# EasyEDA Pro project APFC_硬件.eprj

# Schematic Schematic1
Board Name: UCC28180; Create Date: 2025-06-14; Page Name: P1; Project Name: APFC_硬件; Schematic Name: Schematic1; Update Date: 2025-07-09; Company: 嘉立创EDA; Page Size: A4; Version: V1.0
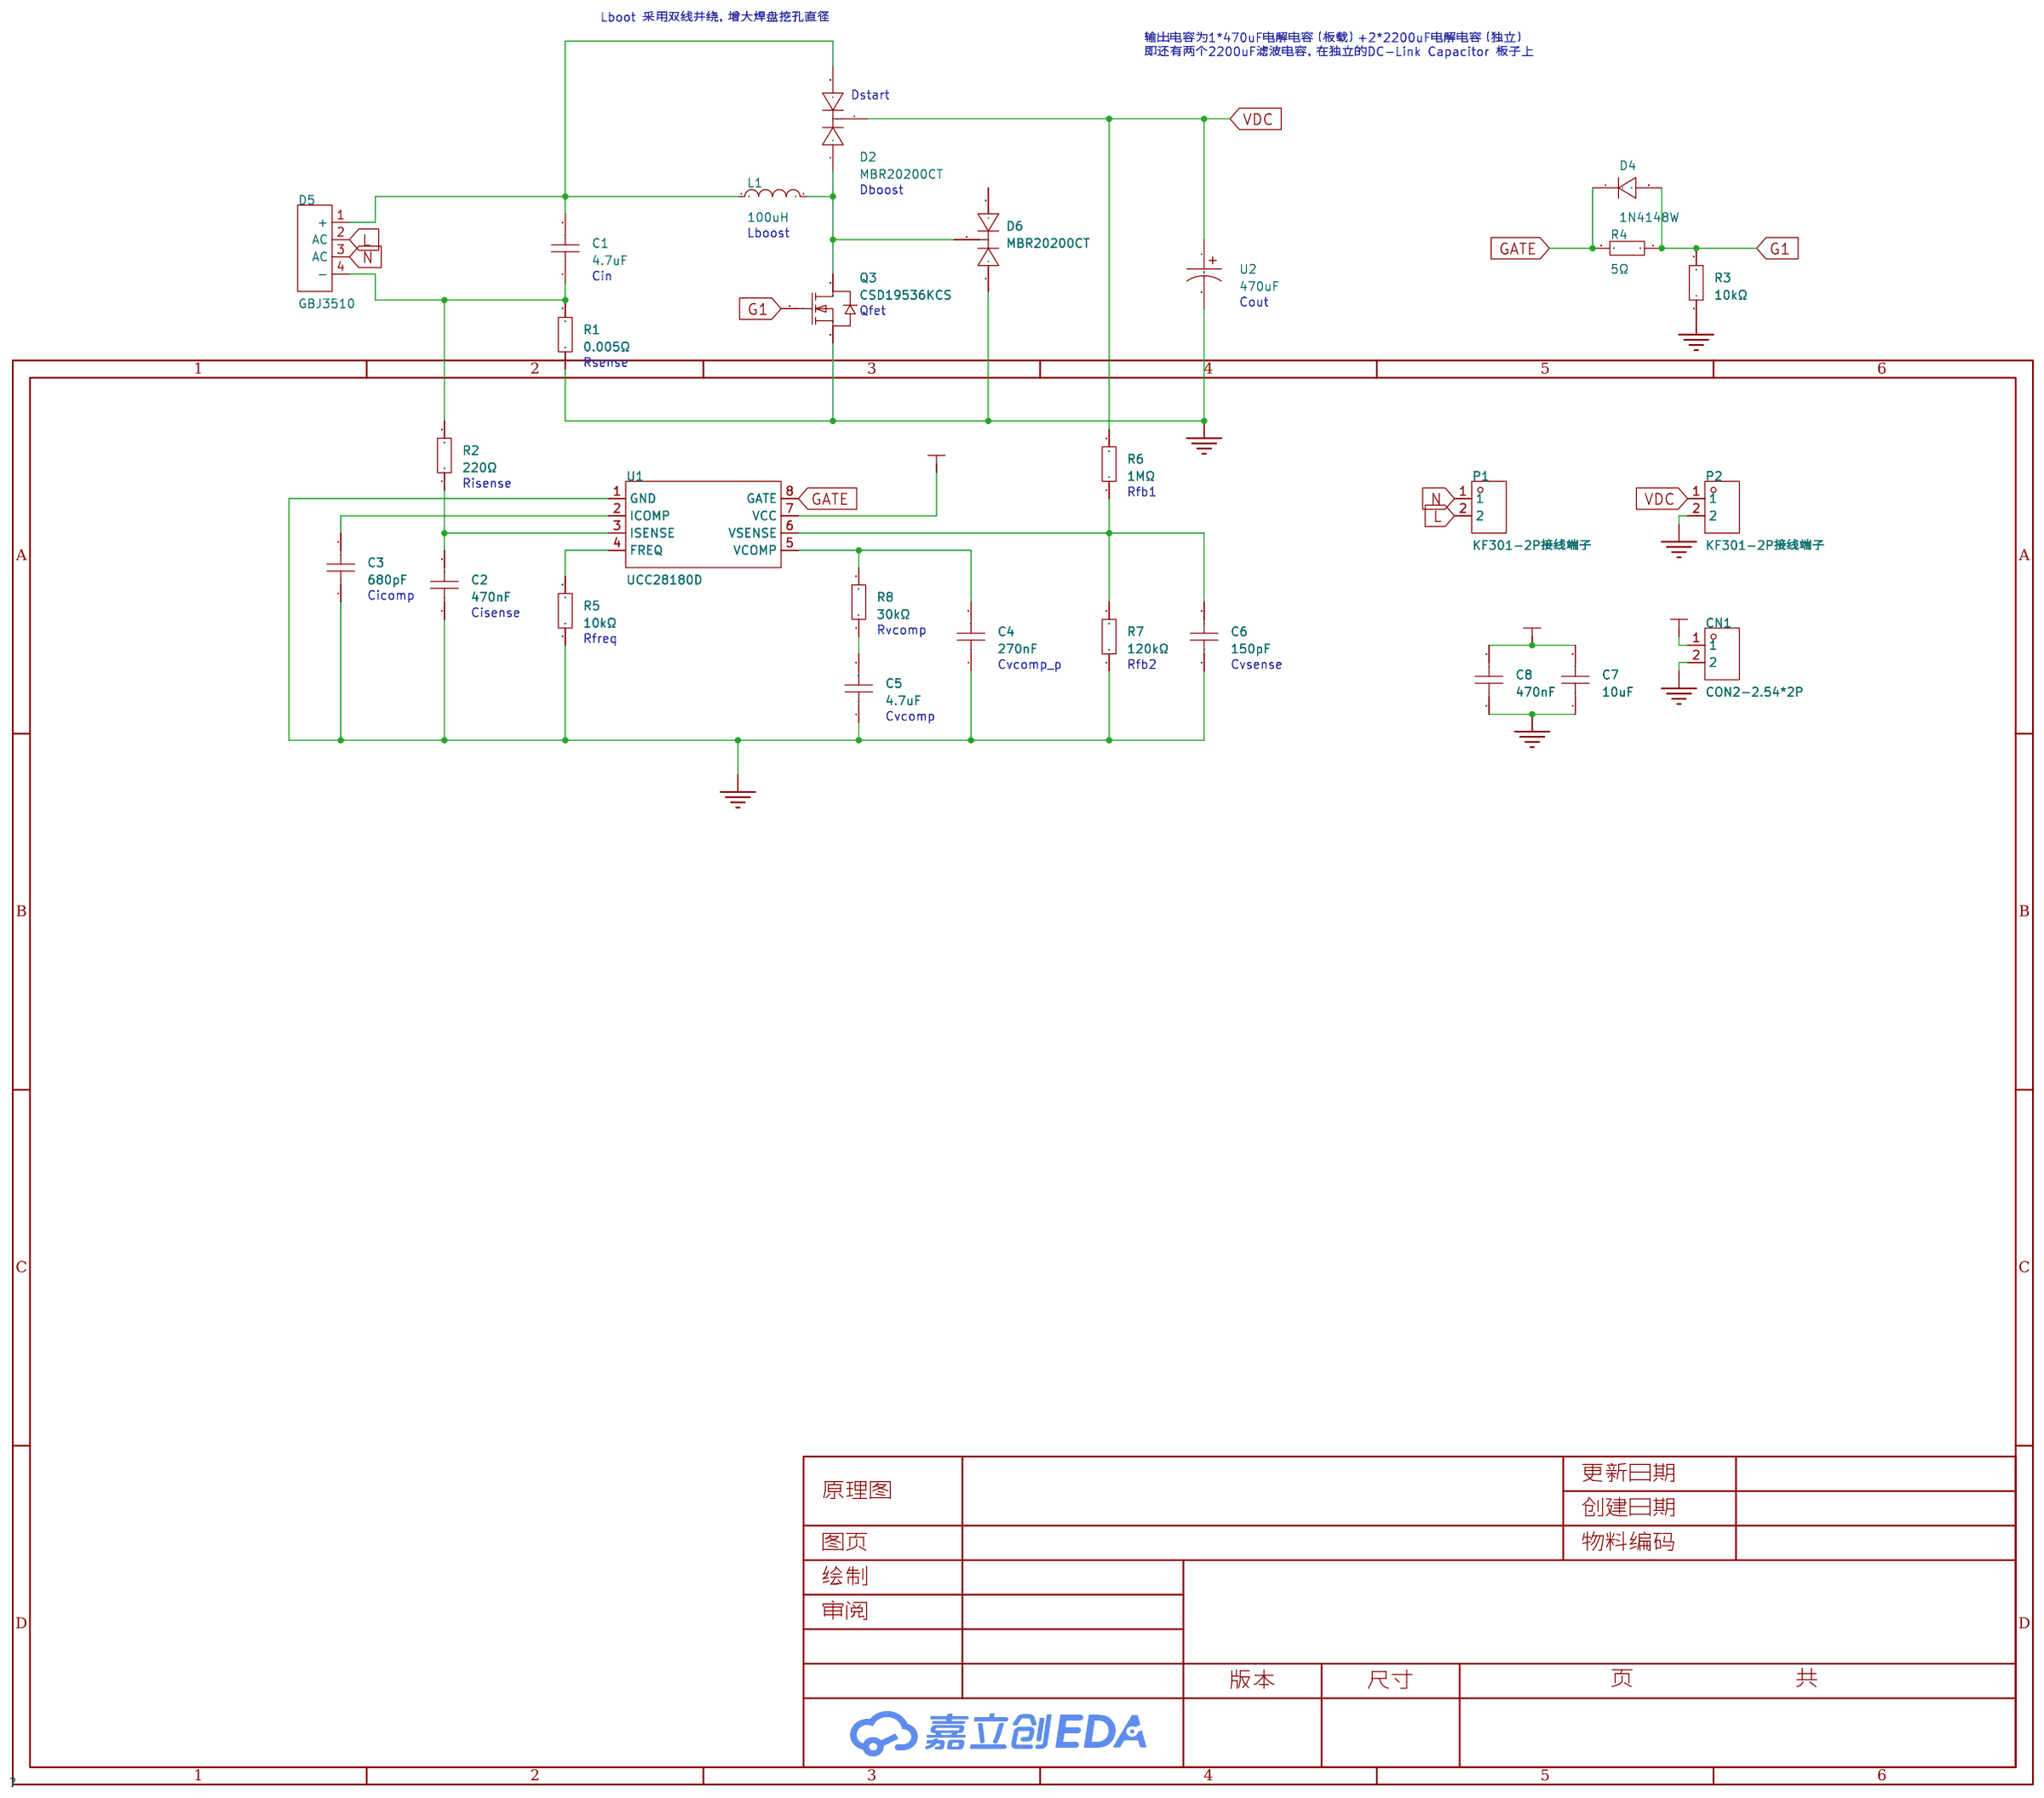
[diagram p0: schematic sheet]

## Parts
C1  4.7uF  [CAP-TH_L27.5-W12.0-P25.00-D1.0]
C2  470nF  [C0805]
C3  680pF  [C0805]
C4  270nF  [C0805]
C5  4.7uF  [C0805]
C6  150pF  [C0805]
C7  10uF  [C0805]
C8  470nF  [C0805]
CN1  CON2-2.54*2P  [CONN-TH_2P-P2.54-V]
D2  MBR20200CT  [TO-220AB-3_L10.4-W4.6-P2.54-T]
D4  1N4148W  [SOD-123F_L2.7-W1.6-LS3.8-RD]
D5  GBJ3510  [GBJ_4P-L30.0-W4.6-L]
D6  MBR20200CT  [TO-220AB-3_L10.4-W4.6-P2.54-T]
L1  100uH  [IND-TH_L33.0-W16.0-P17.00-D1.5]
P1  KF301-2P接线端子  [CONN-TH_XY301V-A-5.0-2P]
P2  KF301-2P接线端子  [CONN-TH_XY301V-A-5.0-2P]
Q3  CSD19536KCS  [TO-220-3_L10.0-W4.5-P2.54-L]
R1  0.005Ω  [R2512]
R2  220Ω  [R0805]
R3  10kΩ  [R0805]
R4  5Ω  [R0805]
R5  10kΩ  [R0805]
R6  1MΩ  [R0805]
R7  120kΩ  [R0805]
R8  30kΩ  [R0805]
U1  UCC28180D  [SOIC-8_L4.9-W3.9-P1.27-LS6.0-BL]
U2  470uF  [CAP-TH_BD22.0-P10.00-D1.4-FD]

## Library data of the parts
C1 = KP475K2G2501: LCSC Part Name: 4.7uF ±10% 400V; Supplier Part: C3019079; Manufacturer: KYET(科雅); Supplier Footprint: 插件,P=25mm; JLCPCB Part Class: 扩展库; Datasheet: https://atta.szlcsc.com/upload/public/pdf/source/20220523/87D483915523636C76AB2708979E5C62.pdf; Supplier: LCSC; Tolerance: ±10%; Voltage Rating: 400V; Operating Temperature: -40℃~+100℃
C2-C8 = CAP_0805: Supplier Footprint: 0805
CN1 = CON2-2.54*2P: Supplier Part: C9900003238; Supplier Footprint: TH-2P; JLCPCB Part Class: Extended Part; Supplier: LCSC
D2 D6 = MBR20200CT_C173469: LCSC Part Name: 电压:200V 电流:20A; Supplier Part: C173469; Manufacturer: MDD(辰达半导体); Supplier Footprint: TO-220AB-3; JLCPCB Part Class: 扩展库; Datasheet: https://atta.szlcsc.com/upload/public/pdf/source/20230823/AA340FD1C1C214AADB9380AD062CBF0B.pdf; Supplier: LCSC; Diode Configuration: 1对共阴极; Voltage - Forward(Vf@If): 950mV@10A; Voltage - DC Reverse(Vr): 200V; Current - Rectified: 20A; Reverse Leakage Current (Ir): 200uA@200V
D4 = 1N4148W_C81598: LCSC Part Name: 电压:75V 电流:150mA; Supplier Part: C81598; Manufacturer: ST(先科); Supplier Footprint: SOD-123; JLCPCB Part Class: Basic Part; Datasheet: https://atta.szlcsc.com/upload/public/pdf/source/20161024/1477288446905.pdf; Supplier: LCSC; Diode Configuration: 独立式; Forward Voltage (Vf@If): 1V@50mA; Reverse Voltage (Vr): 75V; Average Rectified Current (Io): 150mA; Power Dissipation: 400mW; Reverse Leakage Current: 1uA@75V; Reverse Recovery Time (trr): 4ns
D5 = GBJ3510: Supplier Part: C917411; Manufacturer: baocheng(宝乘); Supplier Footprint: GBJ-6; JLCPCB Part Class: 扩展库; Datasheet: https://atta.szlcsc.com/upload/public/pdf/source/20201116/C917411_614230F295128D05D132EEE0C9FE27CA.pdf; Supplier: LCSC; Voltage - Forward(Vf@If): 1.1V@10A; Voltage - DC Reverse(Vr): 1kV; Current - Rectified: 35A; Reverse Leakage Current (Ir): 10uA@1kV; Operating Temperature: -55℃~+150℃@(Tj)
L1 = XR106125TS470MV1L: 电感值:47uH;精度:±10%;额定电流:5A;类型:磁环电感;; LCSC Part Name: 带热缩套管; Supplier Part: C22358528; Manufacturer: XR(祥如); Supplier Footprint: 插件,33x15.6mm; JLCPCB Part Class: 扩展库; Datasheet: https://atta.szlcsc.com/upload/public/pdf/source/20240313/3B46D856669B9C4B865D9288641DA483.pdf; Supplier: LCSC; Tolerance: ±10%; Current Rating: 5A; Type: 磁环电感; Wire Diameter: 1mm
P1 P2 = KF301-2P接线端子: Supplier Part: C9900016950; Supplier Footprint: CK301-2P; JLCPCB Part Class: Extended Part; Supplier: LCSC
Q3 = CSD19536KCS: LCSC Part Name: 1个N沟道 耐压:100V 电流:150A; Supplier Part: C206030; Manufacturer: TI(德州仪器); Supplier Footprint: TO-220; JLCPCB Part Class: 扩展库; Datasheet: https://www.ti.com/cn/lit/gpn/csd19536kcs; Supplier: LCSC; Type: 1个N沟道; Drain Source Voltage (Vdss): 100V; Continuous Drain Current (Id): 150A; Power Dissipation (Pd): 375W; Drain Source On Resistance (RDS(on)@Vgs,Id): 2.7mΩ@10V,100A; Gate Threshold Voltage (Vgs(th)@Id): 3.2V@250uA; Total Gate Charge (Qg@Vgs): 153nC@10V; Input Capacitance (Ciss@Vds): 12nF@50V; Operating Temperature: -55℃~+175℃@(Tj)
R1 = CR2512F110RE04Z: LCSC Part Name: 厚膜电阻 110Ω ±1% 1W; Supplier Part: C245681; Manufacturer: EVER OHMS(天二科技); Supplier Footprint: 2512; JLCPCB Part Class: 扩展库; Datasheet: https://atta.szlcsc.com/upload/public/pdf/source/20240401/D9AD62242E02A8735438DE4371B0E4A3.pdf; Supplier: LCSC; Type: 厚膜电阻; Tolerance: ±1%; Power(Watts): 1W; Overload Voltage (Max): 200V; Temperature Coefficient: ±100ppm/℃; Operating Temperature Range: -55℃~+155℃
R2-R8 = Res_0805: Supplier Footprint: 0805
U1 = UCC28180D: Supplier Part: C2872618; Manufacturer: TI(德州仪器); Supplier Footprint: SOIC-8; JLCPCB Part Class: 扩展库; Datasheet: https://www.ti.com/cn/lit/gpn/ucc28180; Supplier: LCSC; Supply Voltage: 21V; Switching Frequency: 18kHz~250kHz; Operating Temperature: -40℃~+125℃
U2 = ERH2WM221O46OT: 容值:220uF;精度:±20%;额定电压:450V;纹波电流:-;等效串联电阻:-;; LCSC Part Name: 220uF ±20% 450V; Supplier Part: C2937537; Manufacturer: AISHI(艾华集团); Supplier Footprint: 插件,D22xL46mm; JLCPCB Part Class: 扩展库; Datasheet: https://atta.szlcsc.com/upload/public/pdf/source/20211228/8DC8D1CED5B28B034FFD0D50EADAC965.pdf; Supplier: LCSC; Tolerance: ±20%; Rated Voltage: 450V; φD: 22mm; L: 46mm; Lifetime @ Temp: 3000hrs@105℃; Operating Temperature: -40℃~+105℃

## Nets
12V: C7.2 C8.2 CN1.1 U1.7(VCC)
GND: C2.1 C3.1 C4.1 C5.1 C6.1 C7.1 C8.1 CN1.2 D6.1(A) P2.2 Q3.3(S) R1.1 R3.1 R5.1 R7.1 U1.1(GND) U2.2
G1: D4.2(A) Q3.1(G) R3.2 R4.1
GATE: D4.1(K) R4.2 U1.8(GATE)
L: D5.2(AC) P1.2
N: D5.3(AC) P1.1
VDC: D2.2(C) P2.1 R6.2 U2.1
$1N256: C1.2 D2.3(A) D5.1(+) L1.1
$1N261: C1.1 D5.4(-) R1.2 R2.2
$1N1641: C2.2 R2.1 U1.3(ISENSE)
$1N1979: R5.2 U1.4(FREQ)
$1N2007: C3.2 U1.2(ICOMP)
$1N2139: C6.2 R6.1 R7.2 U1.6(VSENSE)
$1N2253: C4.2 R8.2 U1.5(VCOMP)
$1N2269: C5.2 R8.1
$1N3440: D2.1(A) D6.2(C) L1.2 Q3.2(D)

Not connected (* = marked no-connect by the designer): D6 3(A)

## Notes on the sheet
- Lboot 采用双线并绕，增大焊盘挖孔直径
- 输出电容为1*470uF电解电容（板载）+2*2200uF电解电容（独立）
  即还有两个2200uF滤波电容，在独立的DC-Link Capacitor 板子上
- Dstart
- Dboost
- Lboost
- Cin
- Cout
- Qfet
- Rsense
- Risense
- Rfb1
- Cicomp
- Cisense
- Rvcomp
- Rfreq
- Cvcomp_p
- Rfb2
- Cvsense
- Cvcomp

# Schematic Schematic2
Board Name: UCC28019; Create Date: 2025-07-02; Page Name: P1; Project Name: APFC_硬件; Schematic Name: Schematic2; Update Date: 2025-07-05; Company: 嘉立创EDA; Page Size: A4; Version: V1.0
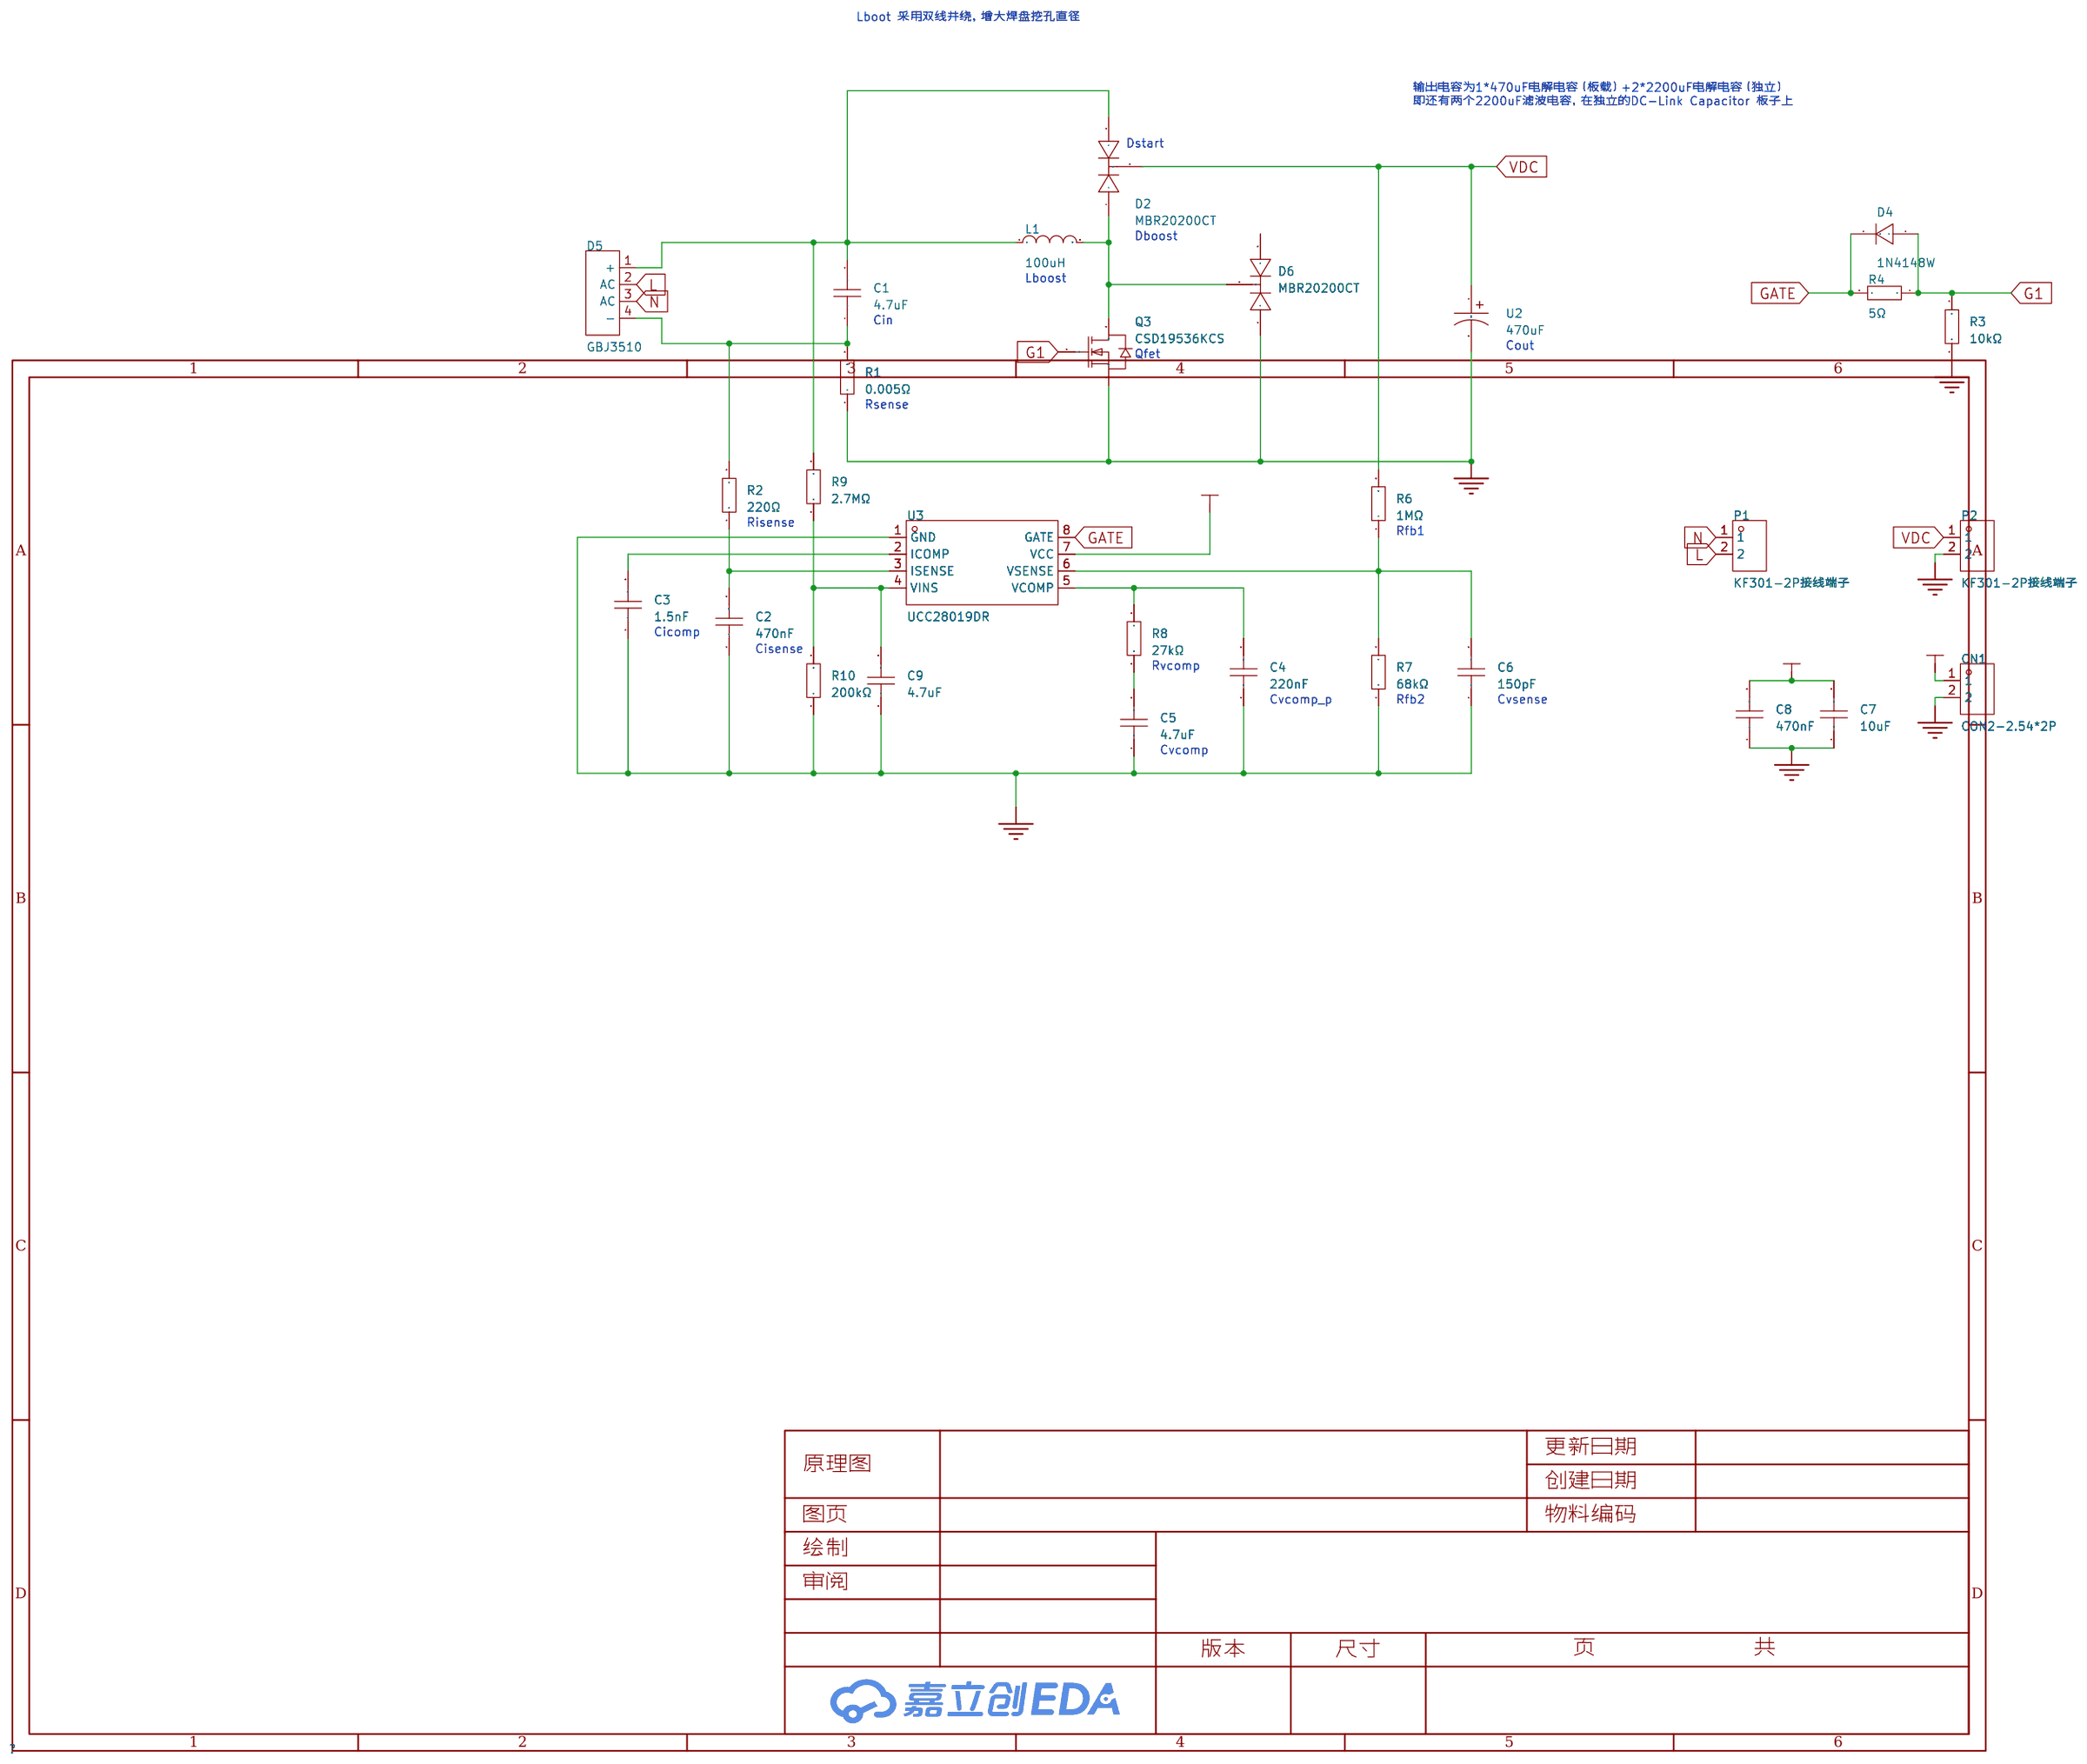
[diagram p1: schematic sheet]

## Parts
C1  4.7uF  [CAP-TH_L27.5-W12.0-P25.00-D1.0]
C2  470nF  [C0805]
C3  1.5nF  [C0805]
C4  220nF  [C0805]
C5  4.7uF  [C0805]
C6  150pF  [C0805]
C7  10uF  [C0805]
C8  470nF  [C0805]
C9  4.7uF  [C0805]
CN1  CON2-2.54*2P  [CONN-TH_2P-P2.54-V]
D2  MBR20200CT  [TO-220AB-3_L10.4-W4.6-P2.54-T]
D4  1N4148W  [SOD-123F_L2.7-W1.6-LS3.8-RD]
D5  GBJ3510  [GBJ_4P-L30.0-W4.6-L]
D6  MBR20200CT  [TO-220AB-3_L10.4-W4.6-P2.54-T]
L1  100uH  [IND-TH_L33.0-W16.0-P17.00-D1.5]
P1  KF301-2P接线端子  [CONN-TH_XY301V-A-5.0-2P]
P2  KF301-2P接线端子  [CONN-TH_XY301V-A-5.0-2P]
Q3  CSD19536KCS  [TO-220-3_L10.0-W4.5-P2.54-L]
R1  0.005Ω  [R2512]
R2  220Ω  [R0805]
R3  10kΩ  [R0805]
R4  5Ω  [R0805]
R6  1MΩ  [R0805]
R7  68kΩ  [R0805]
R8  27kΩ  [R0805]
R9  2.7MΩ  [R0805]
R10  200kΩ  [R0805]
U2  470uF  [CAP-TH_BD22.0-P10.00-D1.4-FD]
U3  UCC28019DR  [SOIC-8_L4.9-W3.8-P1.27-LS6.0-BL]

## Library data of the parts
C1 = KP475K2G2501: LCSC Part Name: 4.7uF ±10% 400V; Supplier Part: C3019079; Manufacturer: KYET(科雅); Supplier Footprint: 插件,P=25mm; JLCPCB Part Class: 扩展库; Datasheet: https://atta.szlcsc.com/upload/public/pdf/source/20220523/87D483915523636C76AB2708979E5C62.pdf; Supplier: LCSC; Tolerance: ±10%; Voltage Rating: 400V; Operating Temperature: -40℃~+100℃
C2-C9 = CAP_0805: Supplier Footprint: 0805
CN1 = CON2-2.54*2P: Supplier Part: C9900003238; Supplier Footprint: TH-2P; JLCPCB Part Class: Extended Part; Supplier: LCSC
D2 D6 = MBR20200CT_C173469: LCSC Part Name: 电压:200V 电流:20A; Supplier Part: C173469; Manufacturer: MDD(辰达半导体); Supplier Footprint: TO-220AB-3; JLCPCB Part Class: 扩展库; Datasheet: https://atta.szlcsc.com/upload/public/pdf/source/20230823/AA340FD1C1C214AADB9380AD062CBF0B.pdf; Supplier: LCSC; Diode Configuration: 1对共阴极; Voltage - Forward(Vf@If): 950mV@10A; Voltage - DC Reverse(Vr): 200V; Current - Rectified: 20A; Reverse Leakage Current (Ir): 200uA@200V
D4 = 1N4148W_C81598: LCSC Part Name: 电压:75V 电流:150mA; Supplier Part: C81598; Manufacturer: ST(先科); Supplier Footprint: SOD-123; JLCPCB Part Class: Basic Part; Datasheet: https://atta.szlcsc.com/upload/public/pdf/source/20161024/1477288446905.pdf; Supplier: LCSC; Diode Configuration: 独立式; Forward Voltage (Vf@If): 1V@50mA; Reverse Voltage (Vr): 75V; Average Rectified Current (Io): 150mA; Power Dissipation: 400mW; Reverse Leakage Current: 1uA@75V; Reverse Recovery Time (trr): 4ns
D5 = GBJ3510: Supplier Part: C917411; Manufacturer: baocheng(宝乘); Supplier Footprint: GBJ-6; JLCPCB Part Class: 扩展库; Datasheet: https://atta.szlcsc.com/upload/public/pdf/source/20201116/C917411_614230F295128D05D132EEE0C9FE27CA.pdf; Supplier: LCSC; Voltage - Forward(Vf@If): 1.1V@10A; Voltage - DC Reverse(Vr): 1kV; Current - Rectified: 35A; Reverse Leakage Current (Ir): 10uA@1kV; Operating Temperature: -55℃~+150℃@(Tj)
L1 = XR106125TS470MV1L: 电感值:47uH;精度:±10%;额定电流:5A;类型:磁环电感;; LCSC Part Name: 带热缩套管; Supplier Part: C22358528; Manufacturer: XR(祥如); Supplier Footprint: 插件,33x15.6mm; JLCPCB Part Class: 扩展库; Datasheet: https://atta.szlcsc.com/upload/public/pdf/source/20240313/3B46D856669B9C4B865D9288641DA483.pdf; Supplier: LCSC; Tolerance: ±10%; Current Rating: 5A; Type: 磁环电感; Wire Diameter: 1mm
P1 P2 = KF301-2P接线端子: Supplier Part: C9900016950; Supplier Footprint: CK301-2P; JLCPCB Part Class: Extended Part; Supplier: LCSC
Q3 = CSD19536KCS: LCSC Part Name: 1个N沟道 耐压:100V 电流:150A; Supplier Part: C206030; Manufacturer: TI(德州仪器); Supplier Footprint: TO-220; JLCPCB Part Class: 扩展库; Datasheet: https://www.ti.com/cn/lit/gpn/csd19536kcs; Supplier: LCSC; Type: 1个N沟道; Drain Source Voltage (Vdss): 100V; Continuous Drain Current (Id): 150A; Power Dissipation (Pd): 375W; Drain Source On Resistance (RDS(on)@Vgs,Id): 2.7mΩ@10V,100A; Gate Threshold Voltage (Vgs(th)@Id): 3.2V@250uA; Total Gate Charge (Qg@Vgs): 153nC@10V; Input Capacitance (Ciss@Vds): 12nF@50V; Operating Temperature: -55℃~+175℃@(Tj)
R1 = CR2512F110RE04Z: LCSC Part Name: 厚膜电阻 110Ω ±1% 1W; Supplier Part: C245681; Manufacturer: EVER OHMS(天二科技); Supplier Footprint: 2512; JLCPCB Part Class: 扩展库; Datasheet: https://atta.szlcsc.com/upload/public/pdf/source/20240401/D9AD62242E02A8735438DE4371B0E4A3.pdf; Supplier: LCSC; Type: 厚膜电阻; Tolerance: ±1%; Power(Watts): 1W; Overload Voltage (Max): 200V; Temperature Coefficient: ±100ppm/℃; Operating Temperature Range: -55℃~+155℃
R2-R4 R6-R10 = Res_0805: Supplier Footprint: 0805
U2 = ERH2WM221O46OT: 容值:220uF;精度:±20%;额定电压:450V;纹波电流:-;等效串联电阻:-;; LCSC Part Name: 220uF ±20% 450V; Supplier Part: C2937537; Manufacturer: AISHI(艾华集团); Supplier Footprint: 插件,D22xL46mm; JLCPCB Part Class: 扩展库; Datasheet: https://atta.szlcsc.com/upload/public/pdf/source/20211228/8DC8D1CED5B28B034FFD0D50EADAC965.pdf; Supplier: LCSC; Tolerance: ±20%; Rated Voltage: 450V; φD: 22mm; L: 46mm; Lifetime @ Temp: 3000hrs@105℃; Operating Temperature: -40℃~+105℃
U3 = UCC28019DR: Supplier Part: C2878343; Manufacturer: TI(德州仪器); Supplier Footprint: SOIC-8; JLCPCB Part Class: 扩展库; Datasheet: https://www.ti.com/cn/lit/gpn/ucc28019; Supplier: LCSC; Supply Voltage: 10V~21V; Switching Frequency: 65kHz; Operating Temperature: -40℃~+125℃

## Nets
12V: C7.2 C8.2 CN1.1 U3.7(VCC)
GND: C2.1 C3.1 C4.1 C5.1 C6.1 C7.1 C8.1 C9.1 CN1.2 D6.1(A) P2.2 Q3.3(S) R1.1 R3.1 R7.1 R10.1 U2.2 U3.1(GND)
G1: D4.2(A) Q3.1(G) R3.2 R4.1
GATE: D4.1(K) R4.2 U3.8(GATE)
L: D5.2(AC) P1.2
N: D5.3(AC) P1.1
VDC: D2.2(C) P2.1 R6.2 U2.1
$1N1118: C1.2 D2.3(A) D5.1(+) L1.1 R9.2
$1N1119: C1.1 D5.4(-) R1.2 R2.2
$1N1121: C2.2 R2.1 U3.3(ISENSE)
$1N1129: C3.2 U3.2(ICOMP)
$1N1131: C6.2 R6.1 R7.2 U3.6(VSENSE)
$1N1132: C4.2 R8.2 U3.5(VCOMP)
$1N1133: C5.2 R8.1
$1N1140: D2.1(A) D6.2(C) L1.2 Q3.2(D)
$1N1921: C9.2 R9.1 R10.2 U3.4(VINS)

Not connected (* = marked no-connect by the designer): D6 3(A)

## Notes on the sheet
- Lboot 采用双线并绕，增大焊盘挖孔直径
- 输出电容为1*470uF电解电容（板载）+2*2200uF电解电容（独立）
  即还有两个2200uF滤波电容，在独立的DC-Link Capacitor 板子上
- Dstart
- Dboost
- Lboost
- Cin
- Qfet
- Cout
- Rsense
- Risense
- Rfb1
- Cicomp
- Cisense
- Rvcomp
- Cvcomp_p
- Rfb2
- Cvsense
- Cvcomp

# Board PCB1
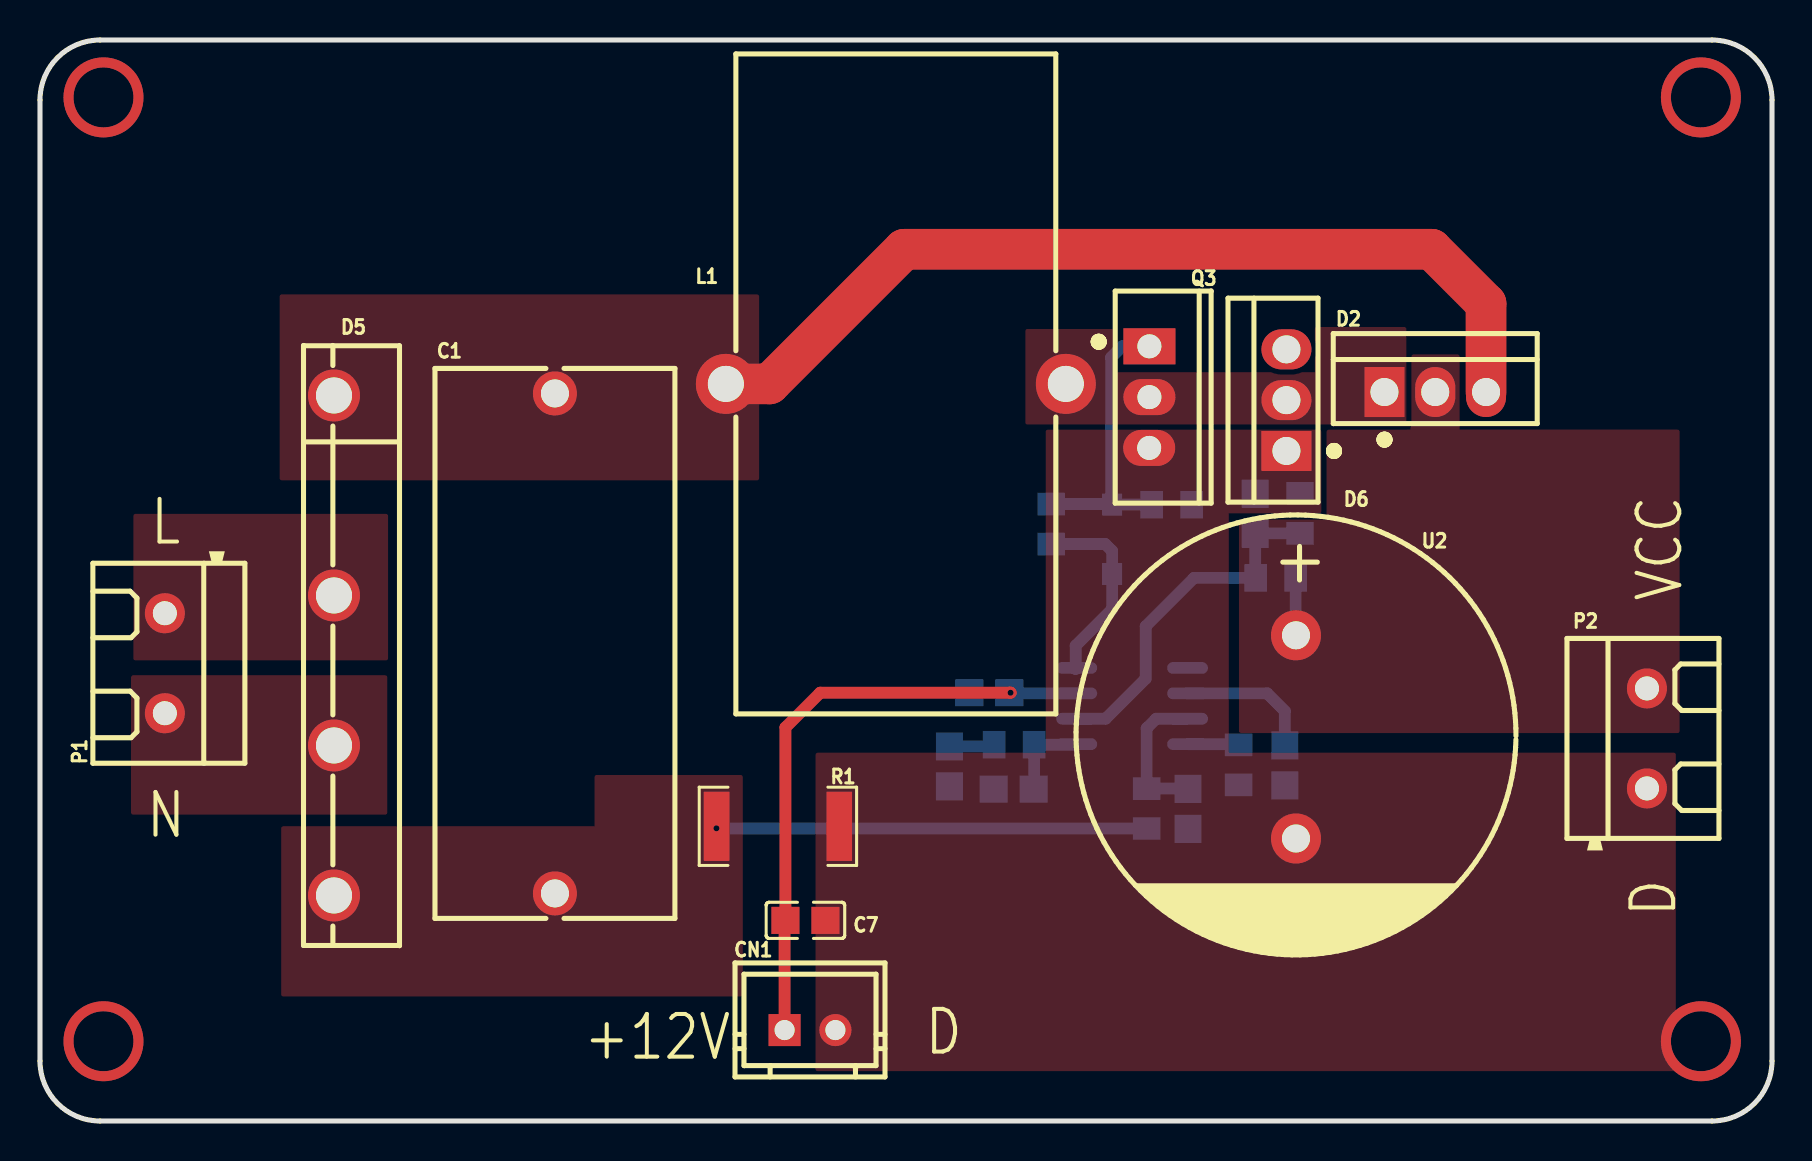
[diagram p2: board, top side]
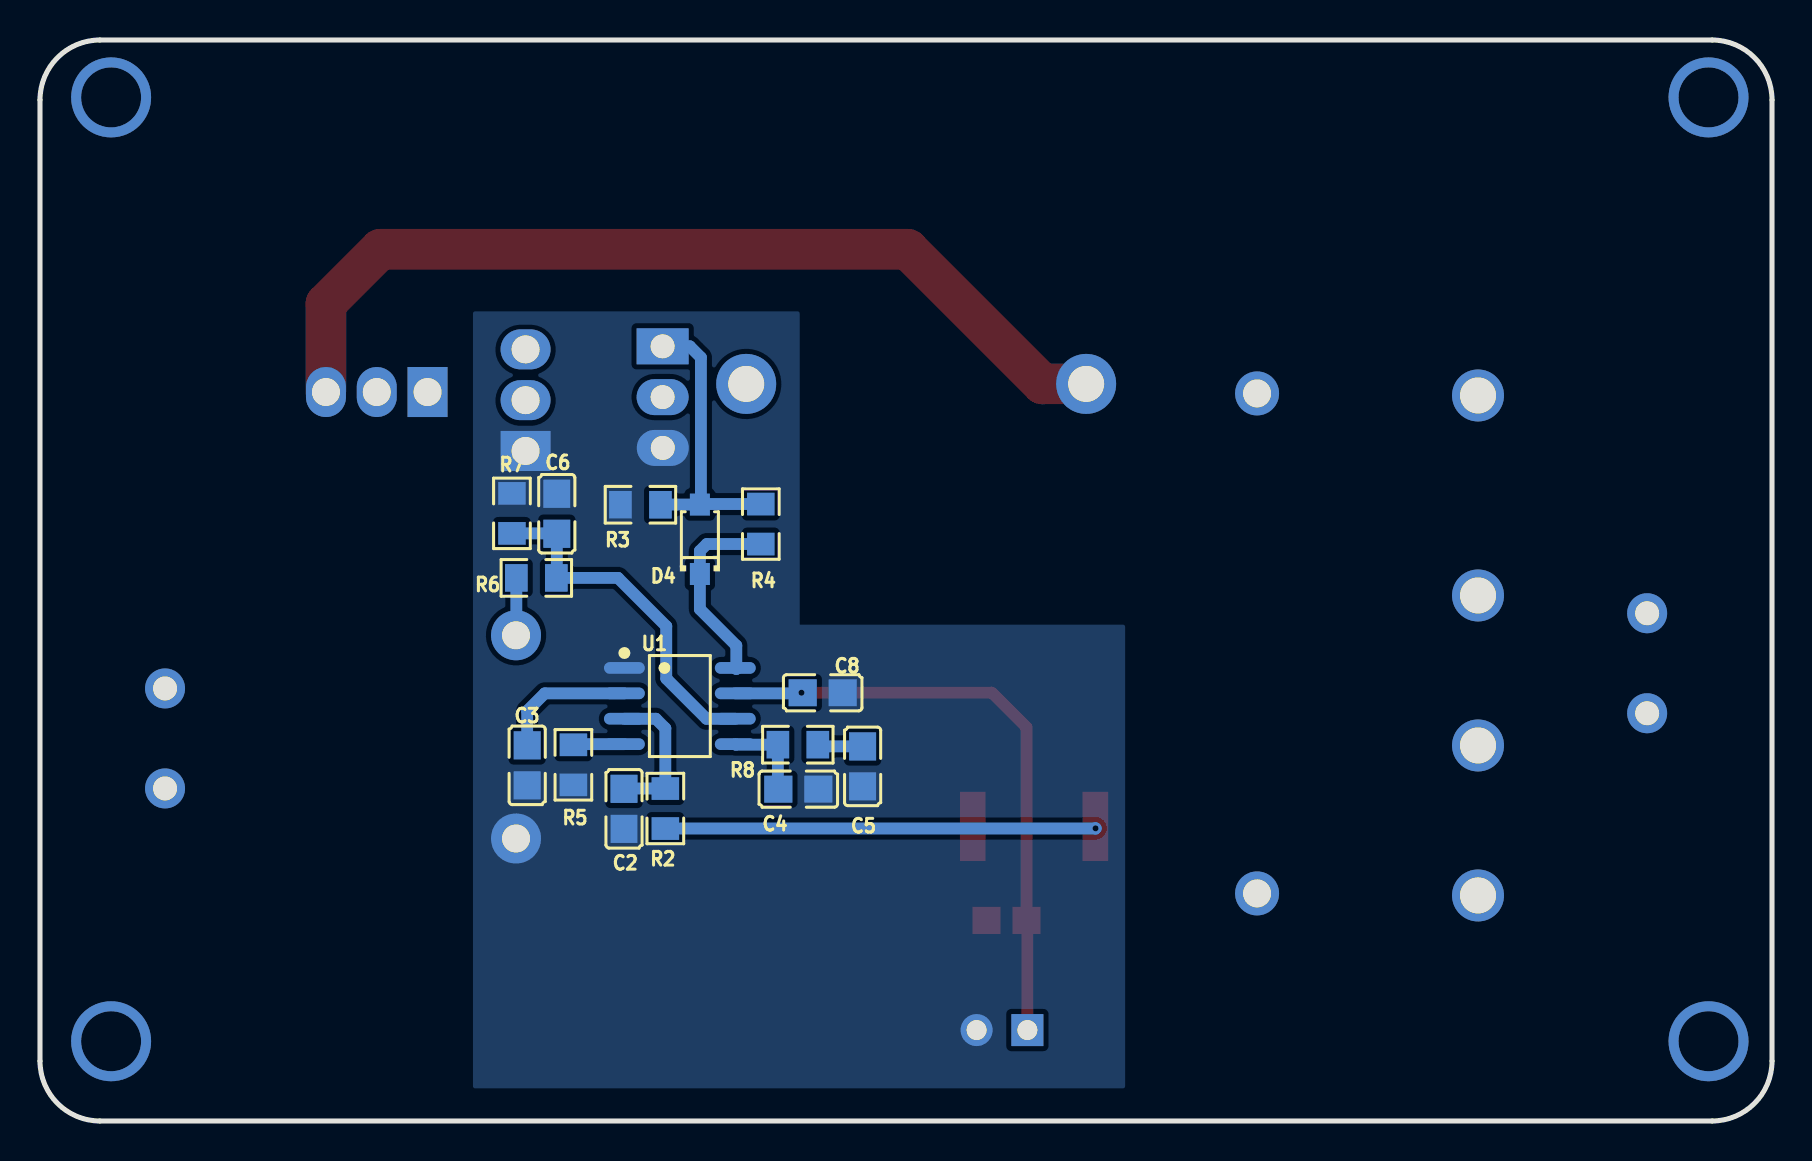
[diagram p3: board, bottom side, seen from below]

Outline 86.61 x 54.05 mm; copper layers: Top Layer, Bottom Layer. Coordinates in mm from the lower left corner of the outline.
Outline path: 0,51.05 0,3 arc(0.88,0.88) 3,0 83.61,0 arc(85.74,0.88) 86.61,3 86.61,51.05 arc(85.74,53.17) 83.61,54.05 3,54.05 arc(0.88,53.17) 0,51.05
Stack: Top Layer 0.035mm / Dielectric1 1.51mm FR4 er 4.5 / Bottom Layer 0.035mm

## Design rules (mm)
template: 自定义配置
spacing copperThickness1oz (default): track to track 0.102, other pairs 0.152 to 0.3
spacing copperThickness2oz: track to track 0.203, other pairs 0.152 to 0.3
track width copperThickness1oz (default): min 0.127, default 0.254, max 2.54
track width copperThickness2oz: min 0.203, default 0.254, max 2.54
differential pair differentialPair (default): width min 0.127, default 0.254, max 2.54; gap min 0.152, default 0.152
via viaSize (default): diameter min 0.5, default 0.61, max 10; hole min 0.3, default 0.305, max 6.3

## Placement (name value [footprint] x y rotation side)
C1  4.7uF  [CAP-TH_L27.5-W12.0-P25.00-D1.0]  25.75 23.88 90 top
C2  470nF  [C0805]  57.41 15.61 90 bottom
C3  680pF  [C0805]  62.25 17.78 90 bottom
C4  270nF  [C0805]  48.69 16.59 0 bottom
C5  4.7uF  [C0805]  45.48 17.73 90 bottom
C6  150pF  [C0805]  60.77 30.36 270 bottom
C7  10uF  [C0805]  38.28 10.03 180 top
C8  470nF  [C0805]  47.47 21.41 0 bottom
CN1  CON2-2.54*2P  [CONN-TH_2P-P2.54-V]  38.51 4.55 0 top
D2  MBR20200CT  [TO-220AB-3_L10.4-W4.6-P2.54-T]  69.77 36.45 90 top
D4  1N4148W  [SOD-123F_L2.7-W1.6-LS3.8-RD]  53.61 29.09 90 bottom
D5  GBJ3510  [GBJ_4P-L30.0-W4.6-L]  14.7 23.78 270 top
D6  MBR20200CT  [TO-220AB-3_L10.4-W4.6-P2.54-T]  62.33 36.04 180 top
L1  100uH  [IND-TH_L33.0-W16.0-P17.00-D1.5]  42.8 36.86 0 top
P1  KF301-2P接线端子  [CONN-TH_XY301V-A-5.0-2P]  6.24 22.89 90 top
P2  KF301-2P接线端子  [CONN-TH_XY301V-A-5.0-2P]  80.36 19.13 270 top
Q3  CSD19536KCS  [TO-220-3_L10.0-W4.5-P2.54-L]  55.47 36.2 270 top
R1  0.005Ω  [R2512]  36.9 14.74 180 top
R2  220Ω  [R0805]  55.34 15.62 270 bottom
R3  10kΩ  [R0805]  56.59 30.81 180 bottom
R4  5Ω  [R0805]  50.57 29.85 270 bottom
R5  10kΩ  [R0805]  59.94 17.81 90 bottom
R6  1MΩ  [R0805]  61.79 27.16 0 bottom
R7  120kΩ  [R0805]  63.01 30.38 270 bottom
R8  30kΩ  [R0805]  48.72 18.82 0 bottom
U1  UCC28180D  [SOIC-8_L4.9-W3.9-P1.27-LS6.0-BL]  54.62 20.75 270 bottom
U2  470uF  [CAP-TH_BD22.0-P10.00-D1.4-FD]  62.81 19.21 270 top

## Footprints (pads in the part's own frame, mm; a bottom-side part is the same pattern mirrored in y, then rotated)
C0805
  rect 1.41x1.35 smd: 1(-1,0) 2(1,0)
CAP-TH_BD22.0-P10.00-D1.4-FD
  round 2.5 hole 1.4: 1(-5.08,0) 2(5.08,0)
CAP-TH_L27.5-W12.0-P25.00-D1.0
  round 2.2 hole 1.4: 1(-12.5,0) 2(12.5,0)
CONN-TH_2P-P2.54-V
  rect 1.6x1.6 hole 1: 1(-1.27,0)
  round 1.6 hole 1: 2(1.27,0)
CONN-TH_XY301V-A-5.0-2P
  round 2 hole 1.2: 1(-2.5,0) 2(2.5,0)
GBJ_4P-L30.0-W4.6-L
  round 2.6 hole 1.8: 1(-12.5,0) 2(-2.5,0) 3(5,0) 4(12.5,0)
IND-TH_L33.0-W16.0-P17.00-D1.5
  round 3 hole 1.8: 1(-8.5,0) 2(8.5,0)
R0805
  rect 1.133x1.377 smd: 1(-1,0) 2(1,0)
R2512
  rect 1.282x3.456 smd: 1(-3.067,0) 2(3.067,0)
SOD-123F_L2.7-W1.6-LS3.8-RD
  rect 1.1x1 smd: 1(-1.735,0) 2(1.735,0)
SOIC-8_L4.9-W3.9-P1.27-LS6.0-BL
  oval 0.588x2.045 smd: 1(-1.905,-2.772) 2(-0.635,-2.772) 3(0.635,-2.772) 4(1.905,-2.772) 5(1.905,2.772) 6(0.635,2.772) 7(-0.635,2.772) 8(-1.905,2.772)
TO-220-3_L10.0-W4.5-P2.54-L
  rect 1.8x2.6 hole 1.2: 1(-2.54,0.005)
  oval 1.8x2.6 hole 1.2: 2(0,0.005) 3(2.54,-0.005)
TO-220AB-3_L10.4-W4.6-P2.54-T
  rect 2.5x2 hole 1.4: 1(0,2.54)
  oval 2.5x2 hole 1.4: 2(0,0) 3(0,-2.54)

## Nets
As in the schematic.

Pads without a net: D6 3

## Via types
v1: diameter 4, hole 3, Top Layer to Bottom Layer, 4 vias
v2: diameter 0.61, hole 0.305, Top Layer to Bottom Layer, 2 vias

## Routing (per net, layer and track width the routed paths; a pad name or vN(x,y) marks a point on that pad's centre or on a via; arc(x,y) is an arc through that point)
12V: length 30.4
  Top Layer w0.59: v2(48.54,21.42) 39.02,21.42 37.28,19.68 C7.2 37.24,9.99 CN1.1
  Bottom Layer w0.59: v2(48.54,21.42) 48.57,21.38 U1.7
GND:
  vias: v1(83.06,3.99)
(no net):
  vias: v1(3.17,51.18) v1(3.17,3.99) v1(83.06,51.18)
G1: length 14.5
  Bottom Layer w0.59: R3.2 55.58,30.82 D4.2 53.56,30.87 ; 53.56,30.87 53.54,30.85 R4.1 ; 53.56,30.87 53.56,38.18 54.12,38.74 Q3.1
GATE: length 9.9
  Bottom Layer w0.59: U1.8 51.79,22.6 51.79,23.77 53.61,25.59 D4.1 53.61,28.5 53.27,28.85 R4.2
VDC: length 2.9
  Bottom Layer w0.254: 62.79,24.3 U2.1
  Bottom Layer w0.59: R6.2 62.79,24.3
$1N256: length 46.3
  Top Layer w2.032: L1.1 36.48,36.86 43.21,43.59 69.6,43.59 72.31,40.87 D2.3
$1N261: length 21.5
  Bottom Layer w0.59: v2(33.83,14.63) 33.84,14.62 R2.2
$1N1641: length 7.3
  Bottom Layer w0.59: C2.2 57.39,16.62 R2.1 55.34,19.64 55.82,20.11 57.39,20.11
$1N1979: length 2.6
  Bottom Layer w0.59: U1.4 59.9,18.84 R5.2
$1N2007: length 6.9
  Bottom Layer w0.59: C3.2 62.25,20.5 61.37,21.38 U1.2
$1N2139: length 17.9
  Bottom Layer w0.59: R7.2 60.79,29.38 C6.2 60.77,27.18 R6.1 57.71,27.16 55.3,24.74 55.3,22.12 53.29,20.11 51.84,20.11
$1N2253: length 4.4
  Bottom Layer w0.59: U1.5 51.82,18.82 R8.2 49.72,16.62 C4.2
$1N2269: length 2.3
  Bottom Layer w0.59: R8.1 47.63,18.73 C5.2

## Copper pours and planes (outline as drawn; the poured copper is in the pictures)
GND on Top Layer: 64.08,30.38 59.45,30.38 59.45,18.42 81.81,18.42 81.81,2.49 38.79,2.49 38.79,18.42 50.29,18.42 50.29,34.57 64.08,34.57
GND on Bottom Layer: 32.35,1.63 64.96,1.63 64.96,40.49 48.63,40.49 48.63,24.83 48.62,24.82 32.35,24.82
L on Top Layer: 4.67,30.36 17.4,30.36 17.4,23.03 4.67,23.03
N on Top Layer: 4.55,22.29 17.37,22.29 17.37,15.32 4.55,15.32
VDC on Top Layer: 59.96,30.07 64.34,30.07 64.34,34.57 68.53,34.57 68.53,38.33 70.99,38.33 70.99,34.57 81.99,34.57 81.99,19.4 59.96,19.4
$1N256 on Top Layer: 11.98,41.33 35.96,41.33 35.96,32.03 11.98,32.03
$1N261 on Top Layer: 35.15,6.23 12.06,6.23 12.06,14.74 27.73,14.74 27.73,17.3 35.15,17.3
$1N3440 on Top Layer: 49.28,34.82 49.28,39.6 53.82,39.6 53.82,37.44 63.75,37.44 63.75,39.7 68.33,39.7 68.33,34.82

## Text on the board
Top Silkscreen Layer: N | L | +12V | D | VCC

# Board PCB2
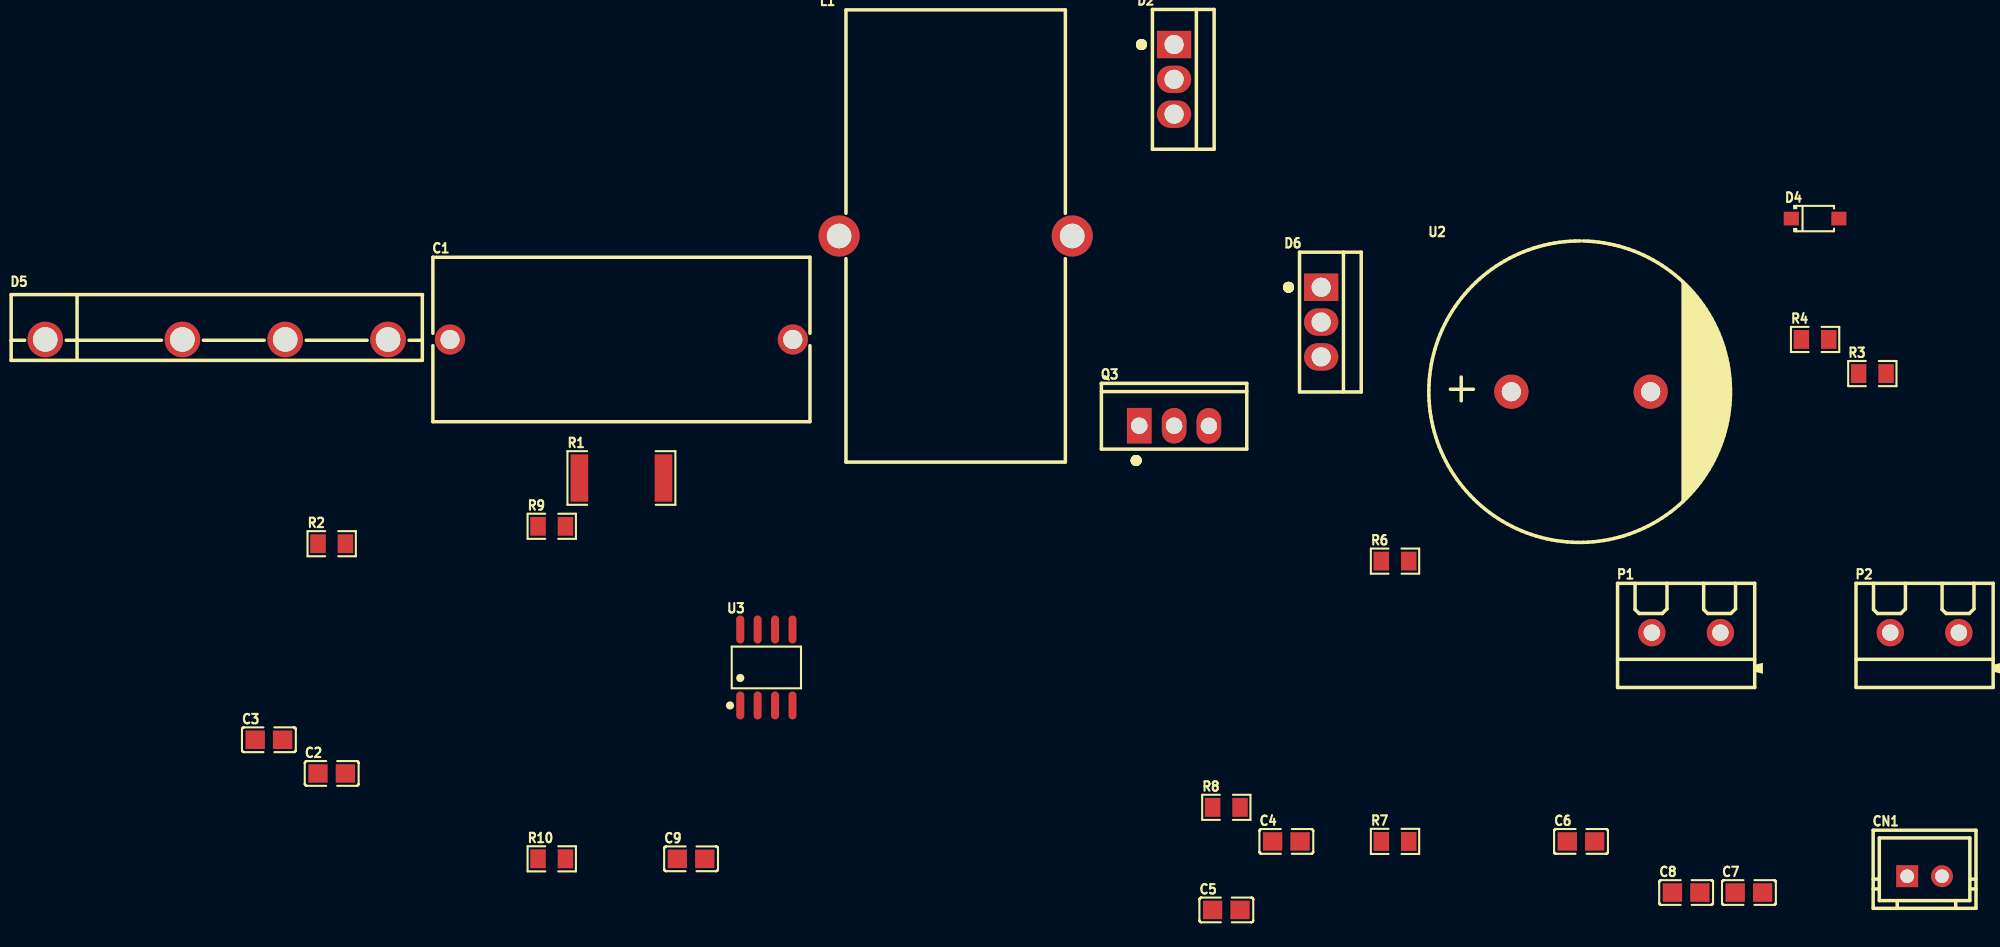
[diagram p4: board, top side]
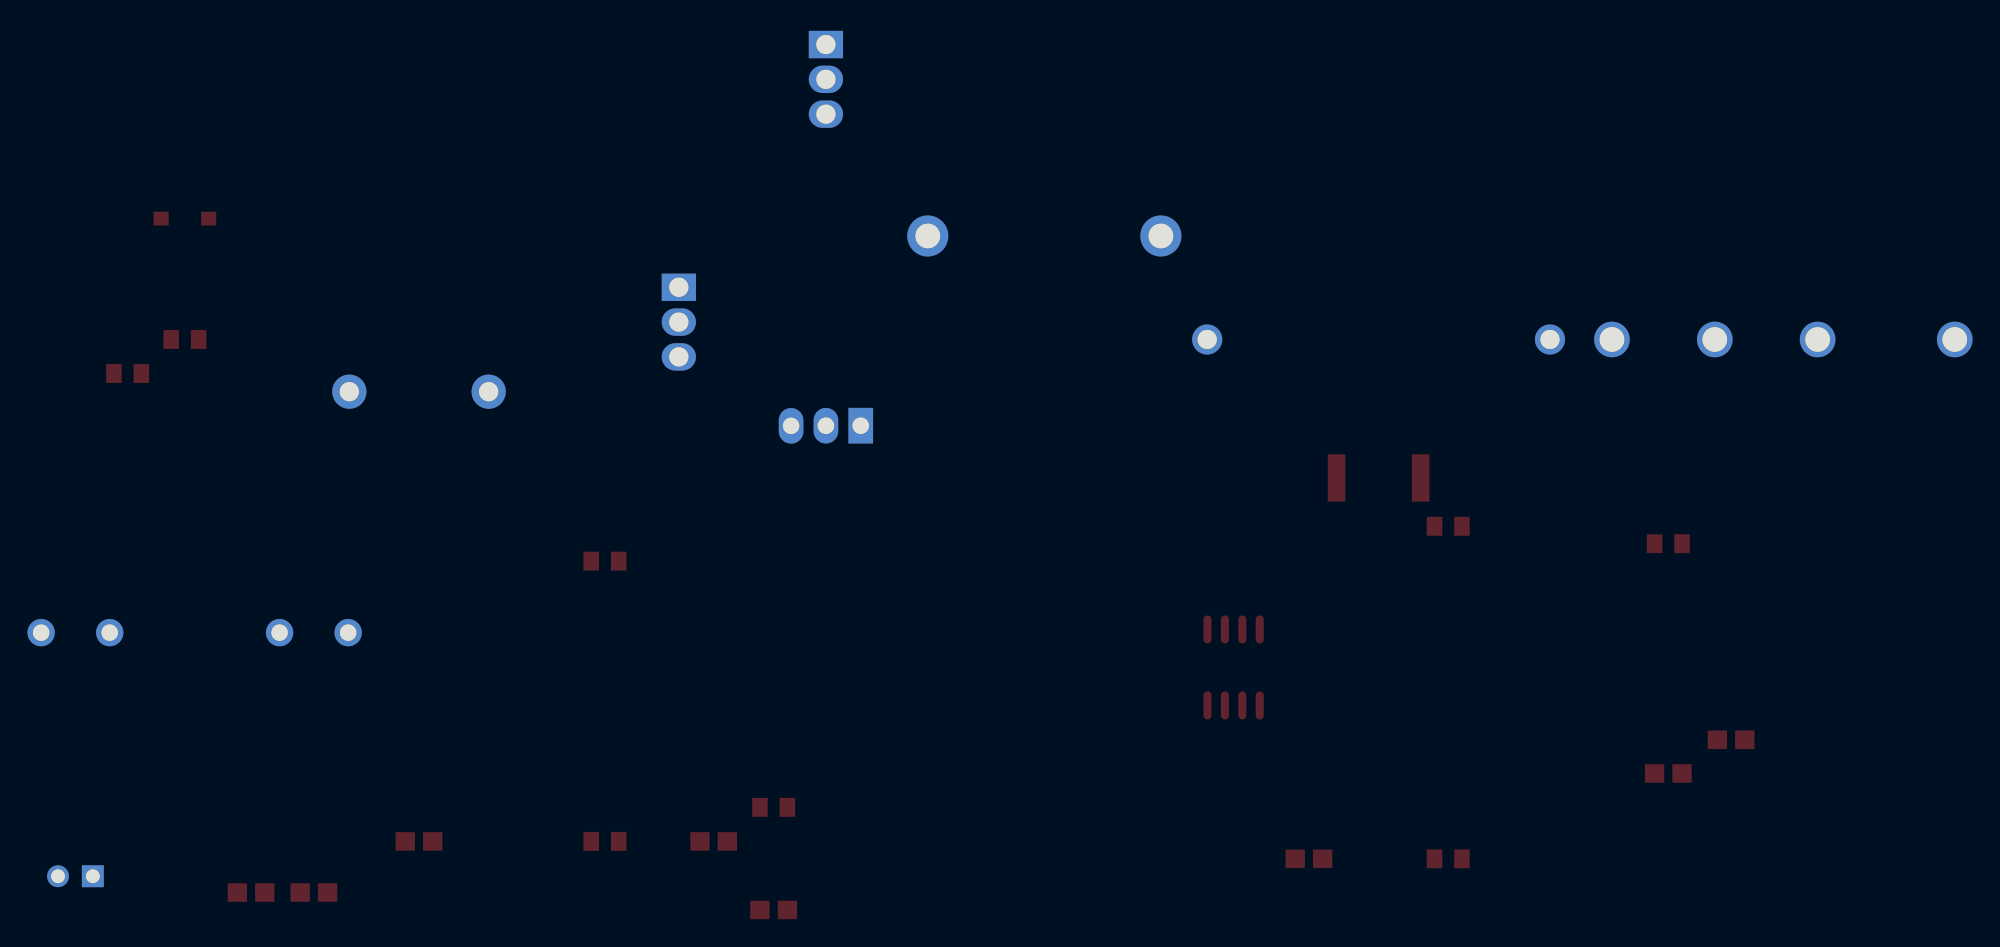
[diagram p5: board, bottom side, seen from below]

No outline. copper layers: Top Layer, Bottom Layer. Coordinates in mm from the lowest, leftmost part position.
Stack: Top Layer 0.035mm / Dielectric1 1.51mm FR4 er 4.5 / Bottom Layer 0.035mm

## Design rules (mm)
template: JLCPCB Capability(Two Layers Board)
spacing copperThickness1oz (default): track to track 0.102, other pairs 0.152 to 0.3
spacing copperThickness2oz: track to track 0.203, other pairs 0.152 to 0.3
track width copperThickness1oz (default): min 0.127, default 0.254, max 2.54
track width copperThickness2oz: min 0.203, default 0.254, max 2.54
differential pair differentialPair (default): width min 0.127, default 0.254, max 2.54; gap min 0.152, default 0.152
via viaSize (default): diameter min 0.5, default 0.61, max 10; hole min 0.3, default 0.305, max 6.3

## Placement (name value [footprint] x y rotation side)
C1  4.7uF  [CAP-TH_L27.5-W12.0-P25.00-D1.0]  29.52 41.63 0 top
C2  470nF  [C0805]  8.39 9.96 0 top
C3  1.5nF  [C0805]  3.81 12.42 0 top
C4  220nF  [C0805]  78.01 5 0 top
C5  4.7uF  [C0805]  73.63 0 0 top
C6  150pF  [C0805]  99.5 5 0 top
C7  10uF  [C0805]  111.75 1.27 0 top
C8  470nF  [C0805]  107.17 1.27 0 top
C9  4.7uF  [C0805]  34.6 3.73 0 top
CN1  CON2-2.54*2P  [CONN-TH_2P-P2.54-V]  124.55 2.46 0 top
D2  MBR20200CT  [TO-220AB-3_L10.4-W4.6-P2.54-T]  69.82 60.61 0 top
D4  1N4148W  [SOD-123F_L2.7-W1.6-LS3.8-RD]  116.57 50.45 0 top
D5  GBJ3510  [GBJ_4P-L30.0-W4.6-L]  0 41.63 0 top
D6  MBR20200CT  [TO-220AB-3_L10.4-W4.6-P2.54-T]  80.55 42.9 0 top
L1  100uH  [IND-TH_L33.0-W16.0-P17.00-D1.5]  53.89 49.18 0 top
P1  KF301-2P接线端子  [CONN-TH_XY301V-A-5.0-2P]  107.17 20.23 0 top
P2  KF301-2P接线端子  [CONN-TH_XY301V-A-5.0-2P]  124.55 20.23 0 top
Q3  CSD19536KCS  [TO-220-3_L10.0-W4.5-P2.54-L]  69.82 35.33 0 top
R1  0.005Ω  [R2512]  29.52 31.52 0 top
R2  220Ω  [R0805]  8.39 26.72 0 top
R3  10kΩ  [R0805]  120.74 39.14 0 top
R4  5Ω  [R0805]  116.57 41.63 0 top
R6  1MΩ  [R0805]  85.94 25.45 0 top
R7  68kΩ  [R0805]  85.94 5 0 top
R8  27kΩ  [R0805]  73.63 7.49 0 top
R9  2.7MΩ  [R0805]  24.44 27.99 0 top
R10  200kΩ  [R0805]  24.44 3.73 0 top
U2  470uF  [CAP-TH_BD22.0-P10.00-D1.4-FD]  99.5 37.82 0 top
U3  UCC28019DR  [SOIC-8_L4.9-W3.8-P1.27-LS6.0-BL]  40.09 17.69 0 top

## Footprints (pads in the part's own frame, mm; a bottom-side part is the same pattern mirrored in y, then rotated)
C0805
  rect 1.41x1.35 smd: 1(-1,0) 2(1,0)
CAP-TH_BD22.0-P10.00-D1.4-FD
  round 2.5 hole 1.4: 1(-5.08,0) 2(5.08,0)
CAP-TH_L27.5-W12.0-P25.00-D1.0
  round 2.2 hole 1.4: 1(-12.5,0) 2(12.5,0)
CONN-TH_2P-P2.54-V
  rect 1.6x1.6 hole 1: 1(-1.27,0)
  round 1.6 hole 1: 2(1.27,0)
CONN-TH_XY301V-A-5.0-2P
  round 2 hole 1.2: 1(-2.5,0) 2(2.5,0)
GBJ_4P-L30.0-W4.6-L
  round 2.6 hole 1.8: 1(-12.5,0) 2(-2.5,0) 3(5,0) 4(12.5,0)
IND-TH_L33.0-W16.0-P17.00-D1.5
  round 3 hole 1.8: 1(-8.5,0) 2(8.5,0)
R0805
  rect 1.133x1.377 smd: 1(-1,0) 2(1,0)
R2512
  rect 1.282x3.456 smd: 1(-3.067,0) 2(3.067,0)
SOD-123F_L2.7-W1.6-LS3.8-RD
  rect 1.1x1 smd: 1(-1.735,0) 2(1.735,0)
SOIC-8_L4.9-W3.8-P1.27-LS6.0-BL
  oval 0.588x2.045 smd: 1(-1.905,-2.772) 2(-0.635,-2.772) 3(0.635,-2.772) 4(1.905,-2.772) 5(1.905,2.772) 6(0.635,2.772) 7(-0.635,2.772) 8(-1.905,2.772)
TO-220-3_L10.0-W4.5-P2.54-L
  rect 1.8x2.6 hole 1.2: 1(-2.54,0.005)
  oval 1.8x2.6 hole 1.2: 2(0,0.005) 3(2.54,-0.005)
TO-220AB-3_L10.4-W4.6-P2.54-T
  rect 2.5x2 hole 1.4: 1(0,2.54)
  oval 2.5x2 hole 1.4: 2(0,0) 3(0,-2.54)

## Nets
As in the schematic.

Pads without a net: D6 3
